# Altium schematic sheet TP4057_C7257911_TP4057_C725791.schdoc
size 124 x 101 mm
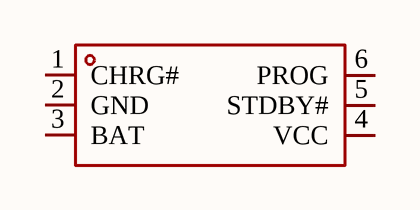
[diagram p0: TP4057_C7257911_TP4057_C725791.schdoc]

## Parts
U?  TP4057  [SOT-23-6_L2.9-W1.6-P0.95-LS2.8-BR]  (value not drawn)

## Nets

Not connected (* = marked no-connect by the designer): U? 1(CHRG#) 2(GND) 3(BAT) 4(VCC) 5(STDBY#) 6(PROG)

## Library data of the parts
U? = TP4057: Manufacturer: UMW(友台半导体); Symbol: TP4057_C725791; Add into BOM: yes; Supply Voltage: 6.5V; Maximum Charge Current: 500mA; Type of Battery: 锂离子/Polymer; Number of Cells: 1; Device: TP4057; LCSC Part Name: TP4057; Supplier Part: C725791; Manufacturer Part: TP4057; Supplier Footprint: SOT-23-6; JLCPCB Part Class: Extended Part; Datasheet: https://atta.szlcsc.com/upload/public/pdf/source/20231109/7FB39B0490CD1514A6792371FCA0BB30.pdf; Supplier: LCSC; Convert to PCB: yes; Operating Temperature: -40℃~+85℃